# EAGLE schematic laundrysensor (EAGLE 9.6.2)
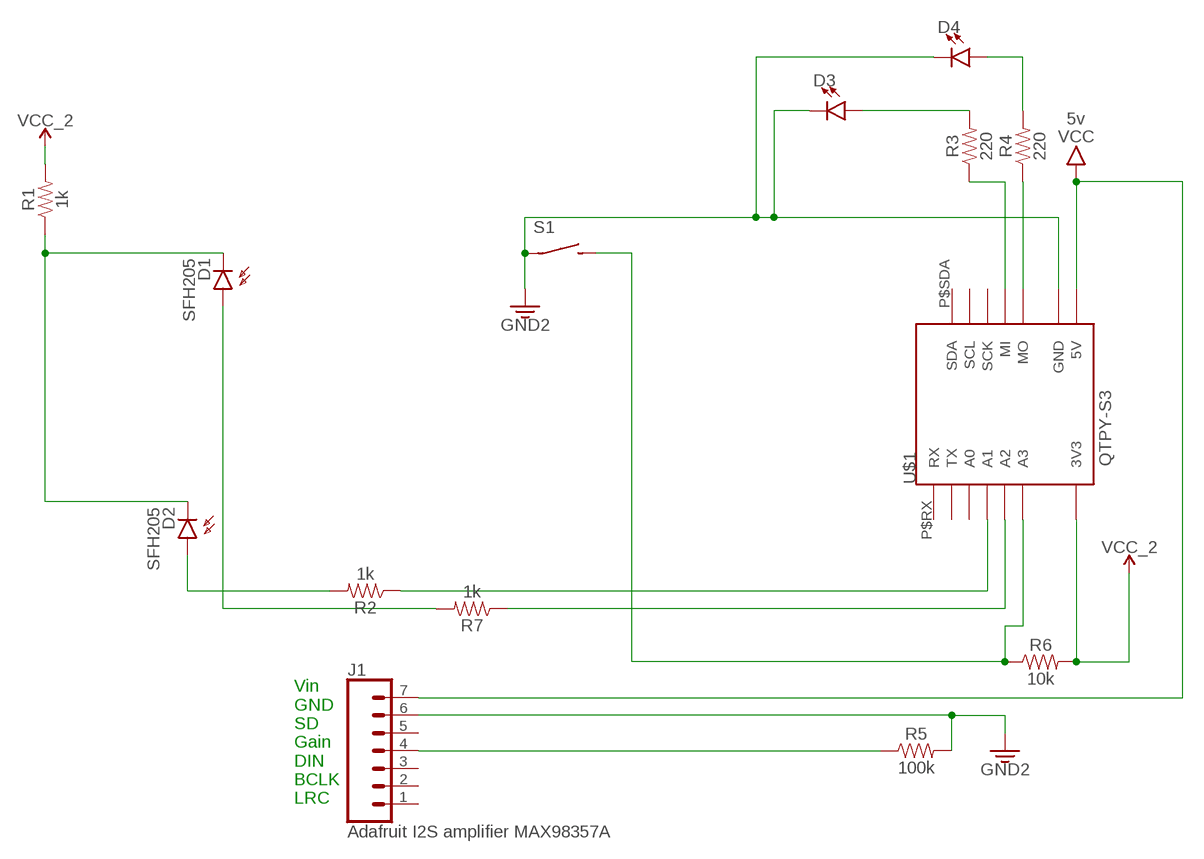
[diagram p0: schematic, sheet 1]

## Parts
D1  SFH205  [SFH205]
D2  SFH205  [SFH205]
D3  LED3MM  [LED_3MM]
D4  LED3MM  [LED_3MM]
J1  Adafruit I2S amplifier MAX98357A  CONN_07  [1X07]
R1  1k  1KOHM-HORIZ-1/4W-5%  [AXIAL-0.3]
R2  1k  1KOHM-HORIZ-1/4W-5%  [AXIAL-0.3]
R3  220  1KOHM-HORIZ-1/4W-5%  [AXIAL-0.3]
R4  220  1KOHM-HORIZ-1/4W-5%  [AXIAL-0.3]
R5  100k  100KOHM-HORIZ-1/4W-1%  [AXIAL-0.3]
R6  10k  10KOHM-HORIZ-1/4W-1%  [AXIAL-0.3]
R7  1k  1KOHM-HORIZ-1/4W-5%  [AXIAL-0.3]
S1  SPST_OFFBOARD_LG  [OFFBOARD_2_LG]
U$1  QTPY-S3  [QTPY-S3]

## Nets
3.3V: D3.K(C) D4.K(C) J1.6 R5.P$2 S1.P$1(P) U$1.P$GND(GND) ; supply symbol labelled GND2
N$1: R4.P$1 U$1.P$MO(MO)
N$2: R3.P$1 U$1.P$MI(MI)
N$3: R2.P$1 U$1.P$A1(A1)
N$4: R6.P$1 S1.P$2(S) U$1.P$A3(A3)
N$5: D1.A R7.P$2
N$6: D2.A R2.P$2
N$7: J1.4 R5.P$1
N$8: R7.P$1 U$1.P$A2(A2)
N$12: D1.K(C) D2.K(C) R1.P$1
N$14: D3.A R3.P$2
N$15: D4.A R4.P$2
VCC: J1.7 U$1.P$5V(5V) ; supply symbol labelled 5v
VCC_2: R1.P$2 R6.P$2 U$1.P$3V(3V3)
Unconnected: J1.1 J1.2 J1.3 J1.5 U$1.P$A0(A0) U$1.P$RX(RX) U$1.P$SCK(SCK) U$1.P$SCL(SCL) U$1.P$SDA(SDA) U$1.P$TX(TX)

## Notes on the sheet
- Vin
  GND
  SD
  Gain
  DIN
  BCLK
  LRC

## Library data of the parts
D1 D2 = opto-trans-siemens:SFH205: PHOTO DIODE; OC_FARNELL: unknown; OC_NEWARK: unknown
D3 D4 = SparkFun-LED:LED: LED (Generic) Standard schematic elements and footprints for 5mm, 3mm, 1206, and 0603 sized LEDs. Generic LEDs with no color specified.; PROD_ID: DIO-08794
J1 = SparkFun-Connectors:CONN_07: Multi connection point. Often used as Generic Header-pin footprint for 0.1 inch spaced/style header connections On any of the 0.1 inch spaced packages, you can populate with these: Break Away Headers - Straight <https://www.sparkfun.com/products/116> (PRT-00116) Break Away Male Headers - Right Angle <https://www.sparkfun.com/products/553> (PRT-00553) Female Headers <https://www.sparkfun.com/products/115> (PRT-00115) Break Away Headers - Machine Pin <https://www.sparkfun.com/products/117> (PRT-00117) Break Away Female Headers - Swiss Machine Pin <https://www.sparkfun.com/products/743> (PRT-00743) For SCREWTERMINALS and SPRING TERMINALS visit here: Screw Terimnals on SparkFun.com <https://www.sparkfun.com/search/results?term=Screw+Terminals> (5mm/3.5mm/2.54mm spacing) This device is also useful as a general connection point to wire up your design to another part of your project. Our various solder wires solder well into these plated through hole pads. Hook-Up Wire - Assortment (Stranded, 22 AWG) <https://www.sparkfun.com/products/11375> (PRT-11375) Hook-Up Wire - Assortment (Solid Core, 22 AWG) <https://www.sparkfun.com/products/11367> (PRT-11367) View the entire wire category on our website here <https://www.sparkfun.com/categories/141> Special notes: Molex polarized connector foot print use with SKU : PRT-08231 with associated crimp pins and housings. 1MM SMD Version SKU: PRT-10208 NOTES ON THE VARIANTS LOCK and LOCK_LONGPADS... This footprint was designed to help hold the alignment of a through-hole component (i.e. 6-pin header) while soldering it into place. You may notice that each hole has been shifted either up or down by 0.005 of an inch from it's more standard position (which is a perfectly straight line). This slight alteration caused the pins (the squares in the middle) to touch the edges of the holes. Because they are alternating, it causes a "brace" to hold the component in place. 0.005 has proven to be the perfect amount of "off-center" position when using our standard breakaway headers. Although looks a little odd when you look at the bare footprint, once you have a header in there, the alteration is very hard to notice. Also,if you push a header all the way into place, it is covered up entirely on the bottom side.
R1 R2 R7 = SparkFun-Resistors:1KOHM: 1kΩ resistor A resistor is a passive two-terminal electrical component that implements electrical resistance as a circuit element. Resistors act to reduce current flow, and, at the same time, act to lower voltage levels within circuits. - Wikipedia; PROD_ID: RES-08380
R3 R4 = SparkFun-Resistors:1KOHM: 1kΩ resistor A resistor is a passive two-terminal electrical component that implements electrical resistance as a circuit element. Resistors act to reduce current flow, and, at the same time, act to lower voltage levels within circuits. - Wikipedia; PROD_ID: RES-08380; VALUE: 1k
R5 = SparkFun-Resistors:100KOHM: 100kΩ resistor A resistor is a passive two-terminal electrical component that implements electrical resistance as a circuit element. Resistors act to reduce current flow, and, at the same time, act to lower voltage levels within circuits. - Wikipedia; PROD_ID: RES-12184
R6 = SparkFun-Resistors:10KOHM: 10kΩ resistor A resistor is a passive two-terminal electrical component that implements electrical resistance as a circuit element. Resistors act to reduce current flow, and, at the same time, act to lower voltage levels within circuits. - Wikipedia; PROD_ID: RES-12183
S1 = bt_electromech:SPST: SPST SWITCH
U$1 = jorjlib:QTPY-S3